# EAGLE design BLMD_MCU (EAGLE 9.6.2)
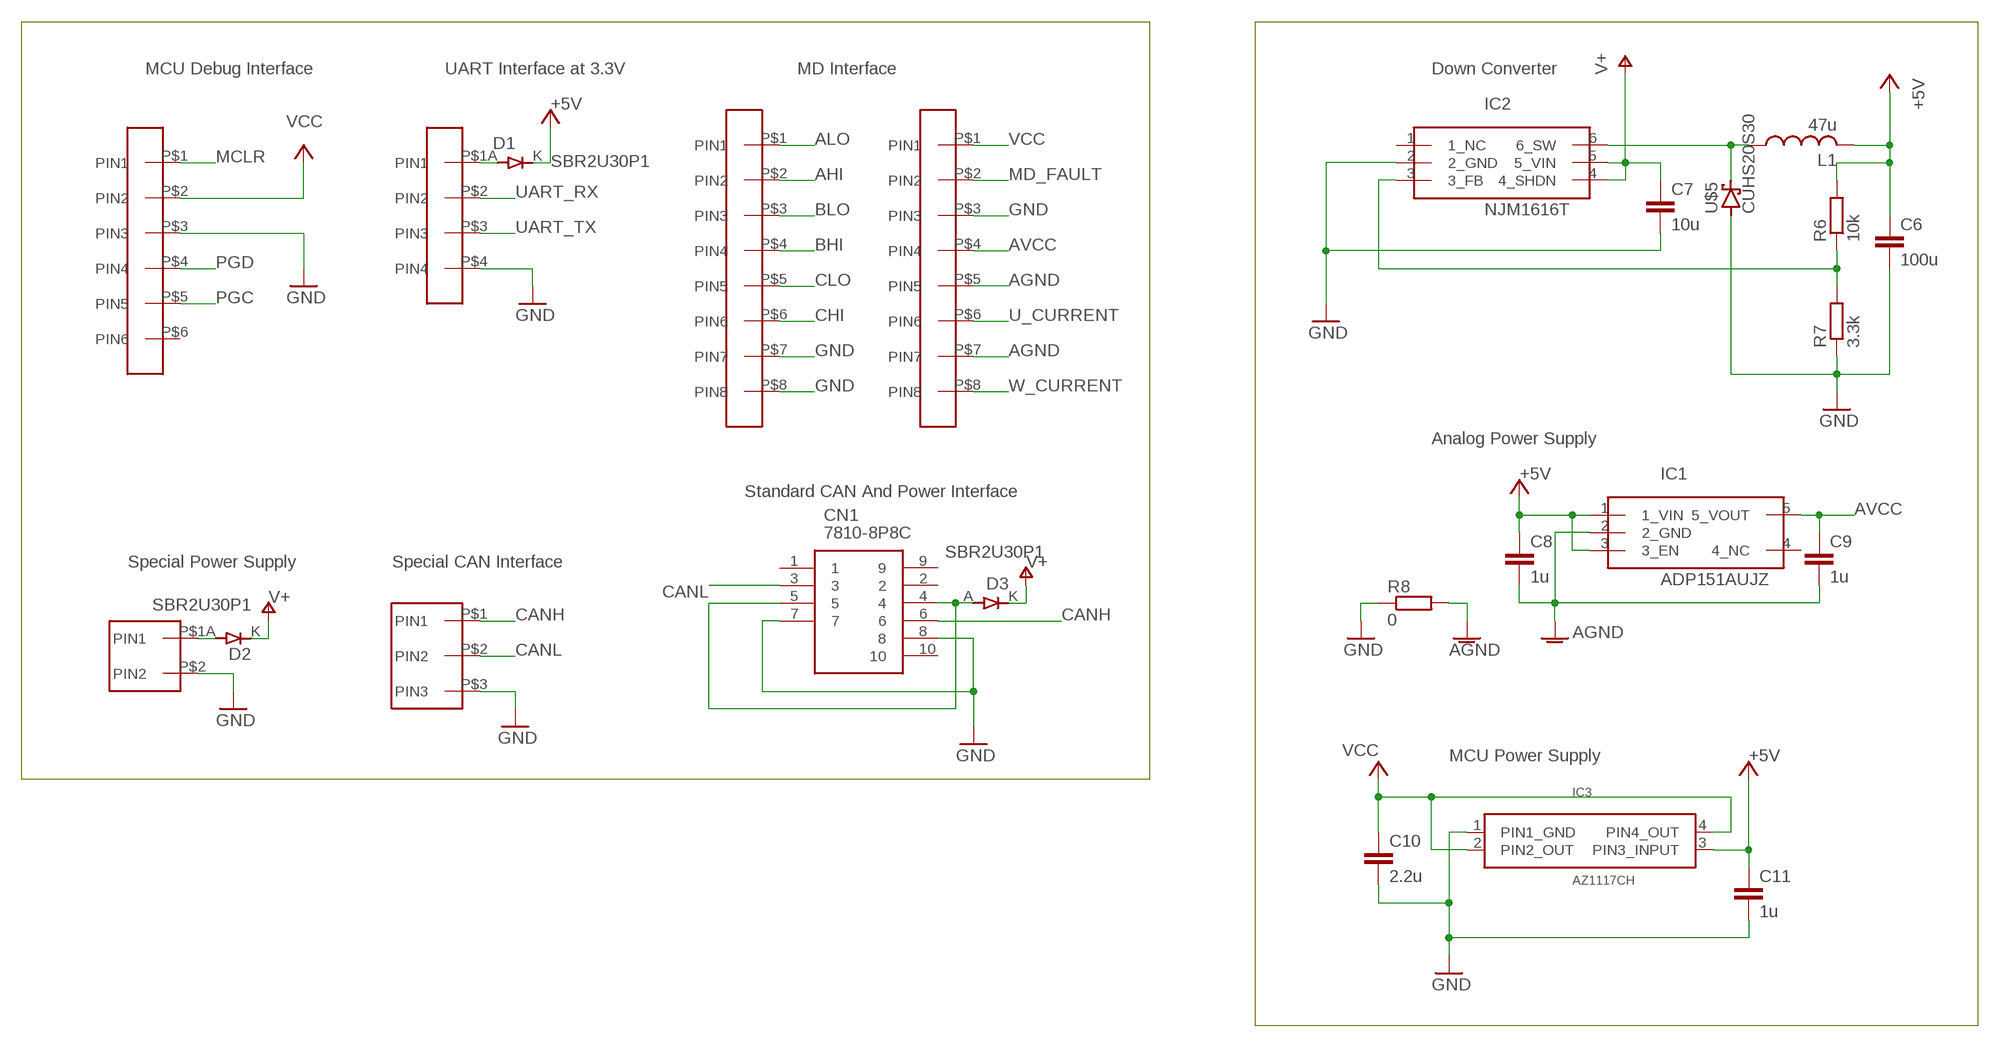
[diagram p0: schematic, sheet 1, part 1 of 2]
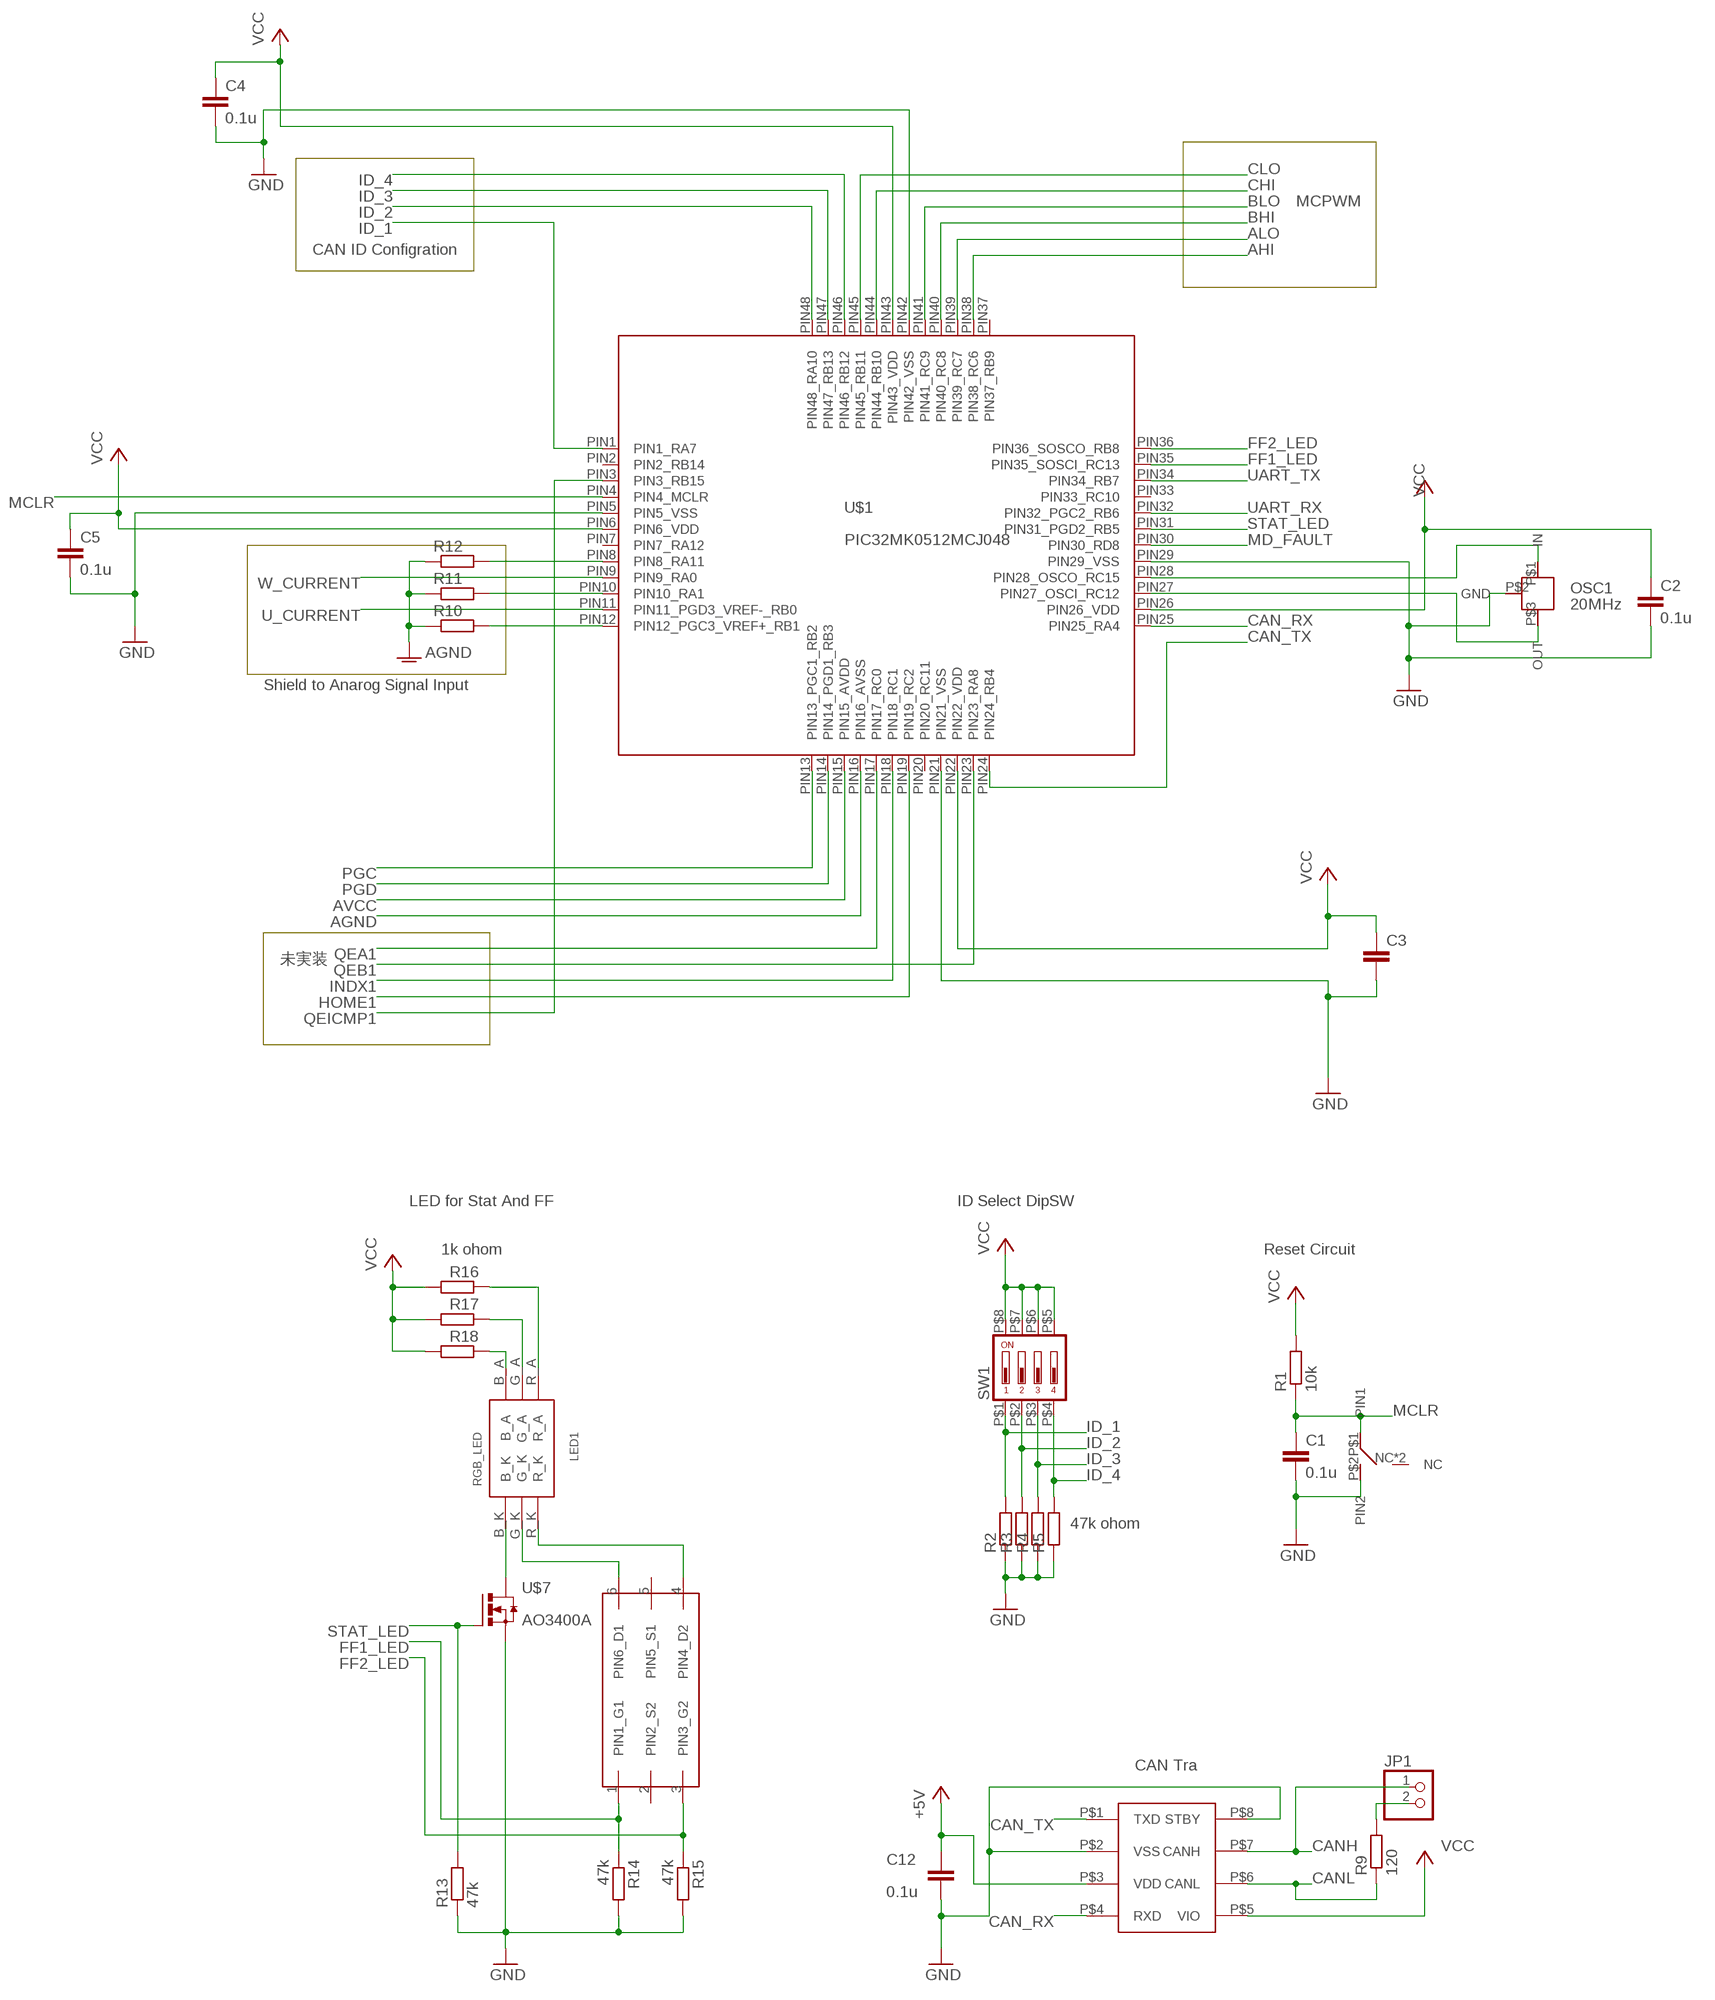
[diagram p1: schematic, sheet 1, part 2 of 2]

## Parts
C1  0.1u  C-EUC1608  [C1608]
C2  0.1u  C-EUC1608  [C1608]
C3  C-EUC1608  [C1608]
C4  0.1u  C-EUC1608  [C1608]
C5  0.1u  C-EUC1608  [C1608]
C6  100u  C-EUC3216  [C3216]
C7  10u  C-EUC1608  [C1608]
C8  1u  C-EUC1608  [C1608]
C9  1u  C-EUC1608  [C1608]
C10  2.2u  C-EUC1608  [C1608]
C11  1u  C-EUC1608  [C1608]
C12  0.1u  C-EUC1608  [C1608]
CN1  7810-8P8C  [78108P8C]
CON1  JQ_S8P  [JQ_S8P]
CON2  JQ_S8P  [JQ_S8P]
CON3  XH_4P  [XH_4P]
CON4  XH_6P  [XH_6P]
CON5  XH_3P  [XH_3P]
D1  SBR2U30P1  SMD_DAIOD  [SOD_123]
D2  SBR2U30P1  SMD_DAIOD  [SOD_123]
D3  SBR2U30P1  SMD_DAIOD  [SOD_123]
IC1  ADP151AUJZ  [SOT23-5]
IC2  NJM1616T  NJW1616T  [SOT23-6]
IC3  AZ1117CH  [SOT223-W]
IC4  MCP2562MCP2561-SN  [SOIC8]
JP1  PINHD-1X2  [1X02]
L1  47u  L_SMD_INDUCTOR  [SMD_INDUCTOR]
LED1  RGB_LED  [RGB_LED]
OSC1  20MHz  CSTN#  [CSTNE#]
R1  10k  R_REG  [1608]
R2  R_REG  [1608]
R3  R_REG  [1608]
R4  R_REG  [1608]
R5  R_REG  [1608]
R6  10k  R_REG  [1608]
R7  3.3k  R_REG  [1608]
R8  0  R_REG  [1608]
R9  120  R_REG  [1608]
R10  R_REG  [1608]
R11  R_REG  [1608]
R12  R_REG  [1608]
R13  47k  R_REG  [1608]
R14  47k  R_REG  [1608]
R15  47k  R_REG  [1608]
R16  R_REG  [1608]
R17  R_REG  [1608]
R18  R_REG  [1608]
SW1  DIPSW4  [DIPSW4]
U$1  PIC32MK0512MCJ048  [LQFP48PIN]
U$2  TVAF06-A020B-R  TAKUTOSUITTI2  [TAKUTOSUITTI2]
U$4  XH_2P  [XH_2P]
U$5  CUHS20S30  [SOD323-W]
U$6  FDC6305  [SSOT6]
U$7  AO3400A  SOT23_NFET  [SOT23]

## Nets
+5V: C6.1 C8.1 C11.1 C12.1 D1.K(C) IC1.1(1_VIN) IC1.3(3_EN) IC3.3(PIN3_INPUT) IC4.P$3(VDD) L1.P$2 R6.2
AGND: C8.2 C9.2 CON2.P$5(PIN5) CON2.P$7(PIN7) IC1.2(2_GND) R8.2 R10.1 R11.1 R12.1 U$1.PIN16(PIN16_AVSS)
AHI: CON1.P$2(PIN2) U$1.PIN38(PIN38_RC6)
ALO: CON1.P$1(PIN1) U$1.PIN39(PIN39_RC7)
AVCC: C9.1 CON2.P$4(PIN4) IC1.5(5_VOUT) U$1.PIN15(PIN15_AVDD)
BHI: CON1.P$4(PIN4) U$1.PIN40(PIN40_RC8)
BLO: CON1.P$3(PIN3) U$1.PIN41(PIN41_RC9)
CAN_RX: IC4.P$4(RXD) U$1.PIN25(PIN25_RA4)
CAN_TX: IC4.P$1(TXD) U$1.PIN24(PIN24_RB4)
CANH: CN1.6 CON5.P$1(PIN1) IC4.P$7(CANH) JP1.1
CANL: CN1.3 CON5.P$2(PIN2) IC4.P$6(CANL) R9.1
CHI: CON1.P$6(PIN6) U$1.PIN44(PIN44_RB10)
CLO: CON1.P$5(PIN5) U$1.PIN45(PIN45_RB11)
FF1_LED: R14.1 U$1.PIN35(PIN35_SOSCI_RC13) U$6.1(PIN1_G1)
FF2_LED: R15.1 U$1.PIN36(PIN36_SOSCO_RB8) U$6.3(PIN3_G2)
GND: C1.2 C2.2 C3.2 C4.2 C5.2 C6.2 C7.2 C10.2 C11.2 C12.2 CN1.7 CN1.8 CON1.P$7(PIN7) CON1.P$8(PIN8) CON2.P$3(PIN3) CON3.P$4(PIN4) CON4.P$3(PIN3) CON5.P$3(PIN3) IC2.2(2_GND) IC3.1(PIN1_GND) IC4.P$2(VSS) IC4.P$8(STBY) OSC1.P$2(GND) R2.1 R3.1 R4.1 R5.1 R7.1 R8.1 R13.1 R14.2 R15.2 U$1.PIN5(PIN5_VSS) U$1.PIN21(PIN21_VSS) U$1.PIN29(PIN29_VSS) U$1.PIN42(PIN42_VSS) U$2.P$2(PIN2) U$4.P$2(PIN2) U$5.A U$7.PIN2(PIN3_S)
HOME1: U$1.PIN19(PIN19_RC2)
ID_1: R2.2 SW1.P$1 U$1.PIN1(PIN1_RA7)
ID_2: R3.2 SW1.P$2 U$1.PIN48(PIN48_RA10)
ID_3: R4.2 SW1.P$3 U$1.PIN47(PIN47_RB13)
ID_4: R5.2 SW1.P$4 U$1.PIN46(PIN46_RB12)
INDX1: U$1.PIN18(PIN18_RC1)
MCLR: C1.1 CON4.P$1(PIN1) R1.1 U$1.PIN4(PIN4_MCLR) U$2.P$1(PIN1)
MD_FAULT: CON2.P$2(PIN2) U$1.PIN30(PIN30_RD8)
N$1: R12.2 U$1.PIN8(PIN8_RA11)
N$2: R11.2 U$1.PIN10(PIN10_RA1)
N$3: LED1.B_A R18.2
N$4: R10.2 U$1.PIN12(PIN12_PGC3_VREF+_RB1)
N$5: OSC1.P$3(OUT) U$1.PIN27(PIN27_OSCI_RC12)
N$6: OSC1.P$1(IN) U$1.PIN28(PIN28_OSCO_RC15)
N$7: LED1.G_A R17.2
N$8: JP1.2 R9.2
N$9: IC2.6(6_SW) L1.P$1 U$5.C
N$10: IC2.3(3_FB) R6.1 R7.2
N$11: LED1.R_A R16.2
N$12: LED1.B_K U$7.PIN3(PIN2_D)
N$13: CON3.P$1(PIN1) D1.A
N$14: LED1.G_K U$6.6(PIN6_D1)
N$15: LED1.R_K U$6.4(PIN4_D2)
N$16: D2.A U$4.P$1(PIN1)
N$18: CN1.4 CN1.5 D3.A
PGC: CON4.P$5(PIN5) U$1.PIN13(PIN13_PGC1_RB2)
PGD: CON4.P$4(PIN4) U$1.PIN14(PIN14_PGD1_RB3)
QEA1: U$1.PIN17(PIN17_RC0)
QEB1: U$1.PIN23(PIN23_RA8)
QEICMP1: U$1.PIN3(PIN3_RB15)
STAT_LED: R13.2 U$1.PIN31(PIN31_PGD2_RB5) U$7.PIN1(PIN1_G)
U_CURRENT: CON2.P$6(PIN6) U$1.PIN11(PIN11_PGD3_VREF-_RB0)
UART_RX: CON3.P$2(PIN2) U$1.PIN32(PIN32_PGC2_RB6)
UART_TX: CON3.P$3(PIN3) U$1.PIN34(PIN34_RB7)
V+: C7.1 D2.K(C) D3.K(C) IC2.4(4_SHDN) IC2.5(5_VIN)
VCC: C2.1 C3.1 C4.1 C5.1 C10.1 CON2.P$1(PIN1) CON4.P$2(PIN2) IC3.2(PIN2_OUT) IC3.4(PIN4_OUT) IC4.P$5(VIO) R1.2 R16.1 R17.1 R18.1 SW1.P$5 SW1.P$6 SW1.P$7 SW1.P$8 U$1.PIN6(PIN6_VDD) U$1.PIN22(PIN22_VDD) U$1.PIN26(PIN26_VDD) U$1.PIN43(PIN43_VDD)
W_CURRENT: CON2.P$8(PIN8) U$1.PIN9(PIN9_RA0)
Unconnected: CN1.1 CN1.2 CN1.9 CN1.10 CON4.P$6(PIN6) IC1.4(4_NC) IC2.1(1_NC) U$1.PIN2(PIN2_RB14) U$1.PIN7(PIN7_RA12) U$1.PIN20(PIN20_RC11) U$1.PIN33(PIN33_RC10) U$1.PIN37(PIN37_RB9) U$2.NC U$2.NC@2(NC) U$6.2(PIN2_S2) U$6.5(PIN5_S1)

## Notes on the sheet
- MCU Debug Interface | UART Interface at 3.3V | MD Interface | Down Converter
- Analog Power Supply
- Standard CAN And Power Interface
- Special Power Supply | Special CAN Interface
- MCU Power Supply
- MCPWM
- CAN ID Configration
- Shield to Anarog Signal Input
- 未実装
- LED for Stat And FF | ID Select DipSW
- 1k ohom | Reset Circuit
- 47k ohom
- CAN Tra

## Library data of the parts
C1-C12 = rcl:C-EU: CAPACITOR, European symbol; SPICEPREFIX: C
CN1 = user_conector:7810-8P8C: Modular Jack, side entry, shielded Source: Datasheet <http://akizukidenshi.com/download/ds/neltron/7810-XPXC_20180312.pdf> RJ45 秋月電子100159; DESCRIPTION: Modular Jack, side entry, shielded; HEIGHT: 14.75mm; MANUFACTURER_NAME: NELTRON; MANUFACTURER_PART_NUMBER: 7810-8P8C
CON1 CON2 = user_conector:JQ_S8P: jst JQコネクタ8pin ソケット 基板対基板コネクタ
CON3 = user_conector:XH_4P: jst JQコネクタ4pin ベース付きポスト 基板対基板コネクタ
CON4 = user_conector:XH_6P
CON5 = user_conector:XH_3P
D1-D3 = user_diode:SMD_DAIOD: パッケージはSOD123
IC1 = user_ic:ADP151AUJZ: アナログデバイセズ 超低ノイズ3.3V出力リニアレギュレータ max current = 200 [mA] 秋月電子 通販コード : I-14180
IC2 = user_ic:NJW1616T: 新日本無線 降圧スイッチングレギュレータIC NJM1616T 秋月電子 通販コード : I-15765
IC3 = user_ic:AZ1117CH: AZ1117CH-3.3TRG1 秋月電子 116155 vout 3.3v dropout 1.2v Imax 1.35A
IC4 = user_ic:MCP2562
JP1 = pinhead:PINHD-1X2: PIN HEADER
L1 = user_rcl:L_SMD_INDUCTOR: 秋月電子通商 NRシリーズ
LED1 = user_leds:RGB_LED: KPF-3236SURKMGKPBC 秋月電子通商 117060
OSC1 = user_osc:CSTN#: ムラタのセラロック （セラミック振動子） 周波数はいくつか種類あり(valueで設定して) 秋月電子通商のトップ/パーツ一般/発振子/セラミック発振子 uCからのoutが入るのがinであることに注意 https://akizukidenshi.com/catalog/c/cceralock/
R1-R18 = user_rcl:R_REG: チップ抵抗
SW1 = user_swich:DIPSW4: OTAX 表面実装4接点DIPスイッチ 秋月電子 通販コード : P-08929
U$1 = user_ic:PIC32MK0512MCJ048: PIC32MK0512MCJ048 仕様 1. 定格3.3V、32bitMCU、FPU搭載、CAN-FD、QEI 2. モータコントロール向けマイコン
U$2 = user_swich:TAKUTOSUITTI2: 表面実装タクトスイッチ 秋月電子通称通販コード[P-14888]
U$4 = user_conector:XH_2P: トップ型xhコネクタ2ピン 秋月に売ってるやつ
U$5 = user_diode:CUHS20S30: CUHS20S30 秋月電子:116304 Vf=0.25 Aav=2
U$6 = user_tr_fet_igbt:FDC6305: デュアルNchMOSFET ゲート・ソース間絶対最大定格8v 秋月電子通商通販コード[I-06003]
U$7 = user_tr_fet_igbt:SOT23_NFET

## Board
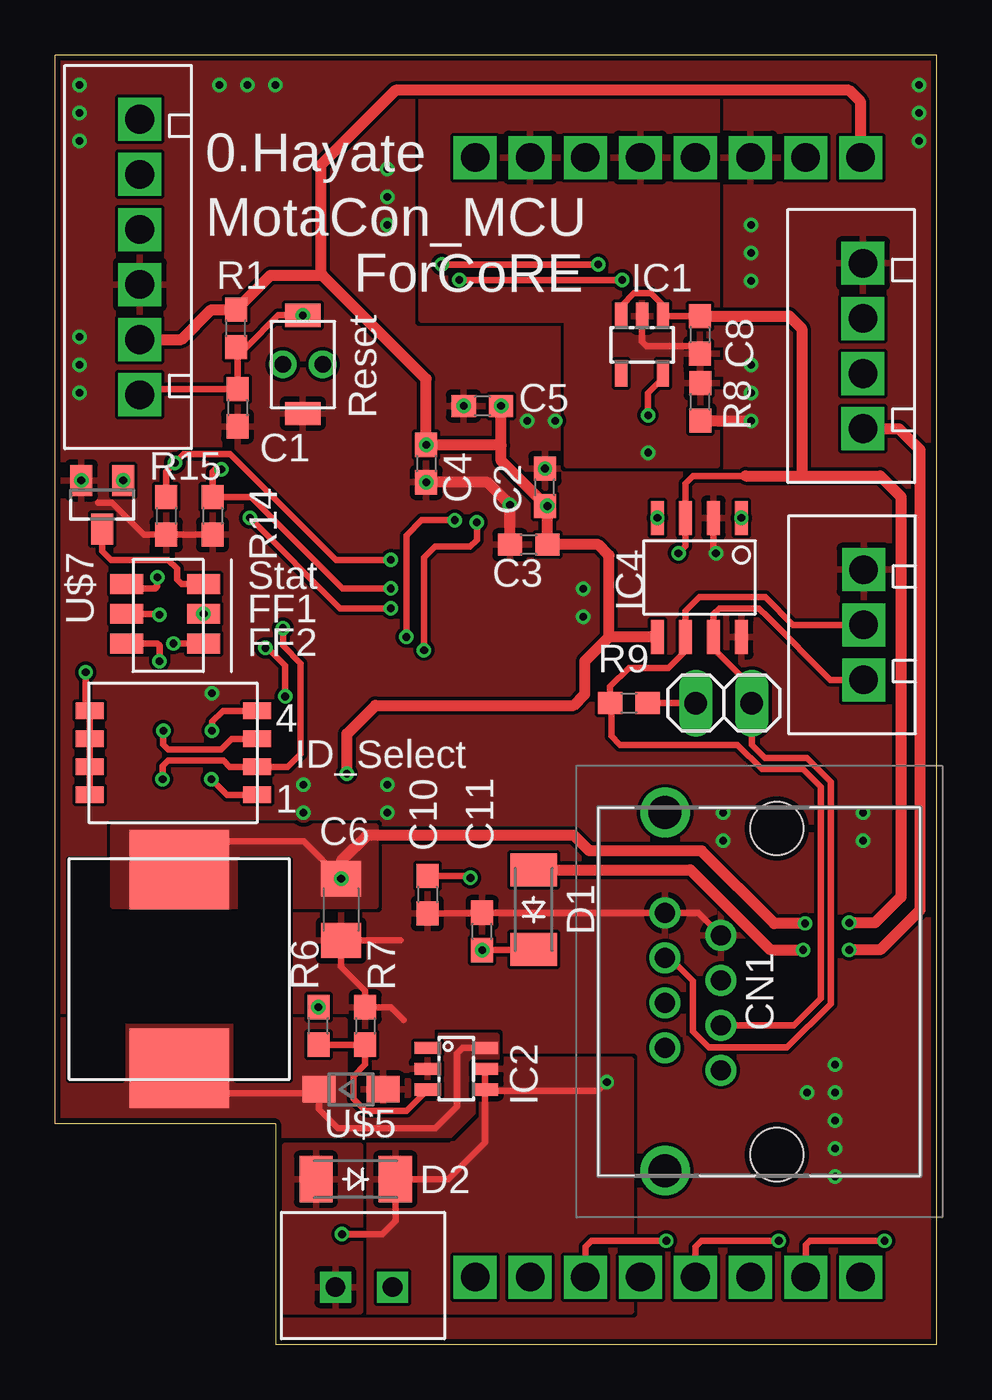
[diagram p2: board, top side]
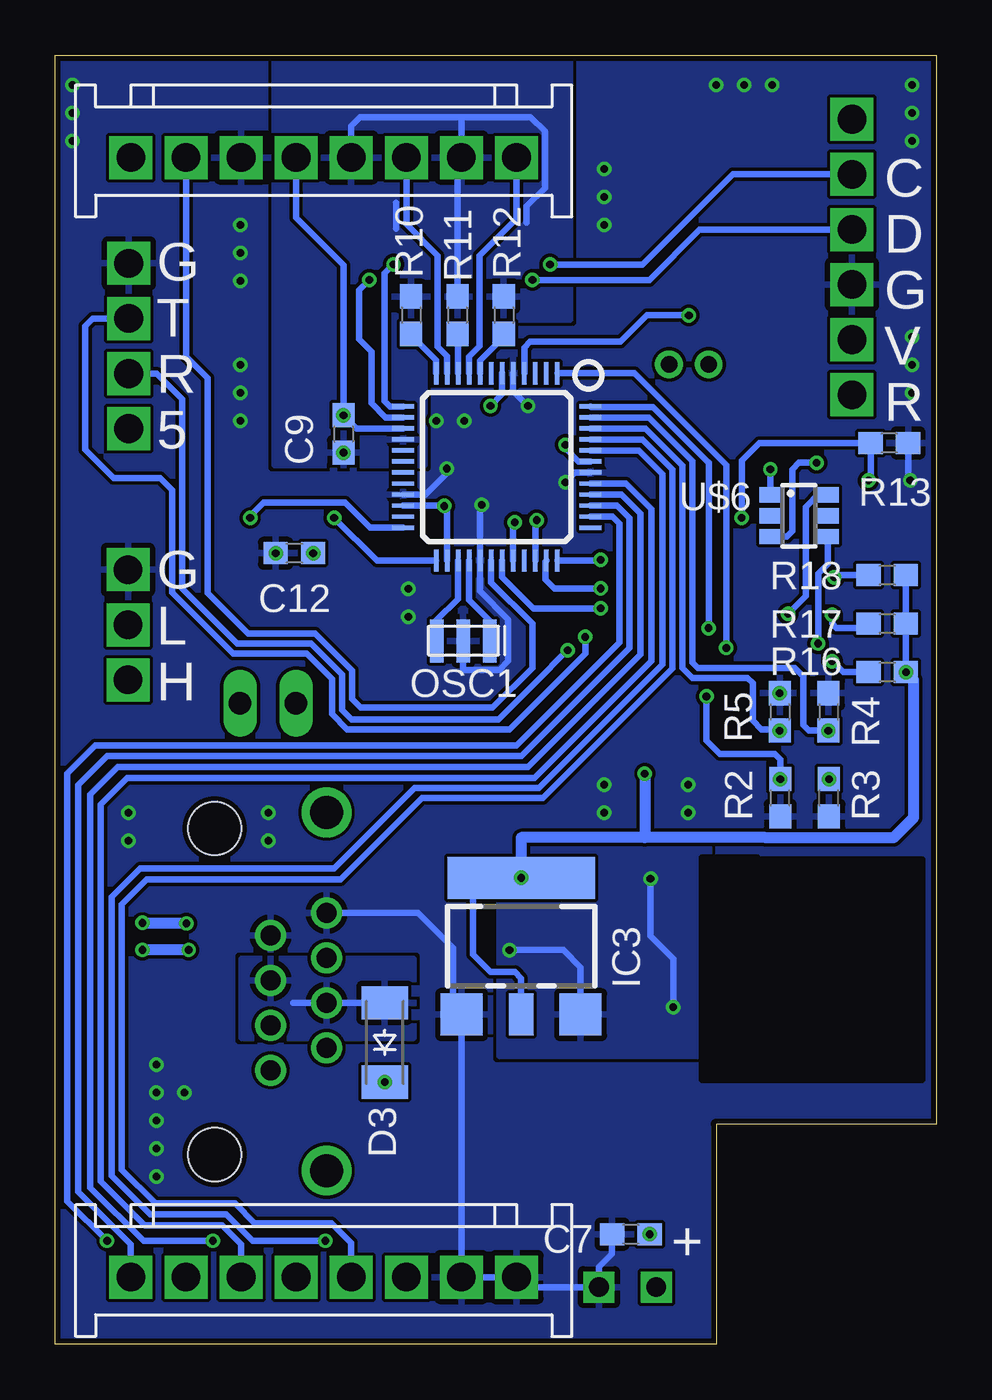
[diagram p3: board, bottom side, seen from below]

Size 40 x 58.5 mm. Coordinates in mm from the lower left corner, seen from the top.
Outline: 10,0 40,0 40,58.5 0,58.5 0,10 10,10 10,0
Copper layers (1*16): Top 0.035mm / dielectric 1.5mm / Bottom 0.035mm
Design rules "SeeedStudio_2layer_DRU_no_angle_20140221": minimum track width 6mil, minimum drill 12mil, track to track 6mil, track to pad 6mil, pad to pad 6mil, via to via 6mil, smd to smd 0mil, copper to edge 10mil, drill to drill 10mil, minimum pad ring 10mil, minimum via ring 6mil, stop-mask expansion 2mil, vias tented up to drill 100mil, thermal gap 10mil

### Footprints (pad centres in the part's own frame; a part is rotated, then mirrored left to right if it is on the bottom)
C1608 = smd 1.1 x 1: 1 -0.85,0; 2 0.85,0
C3216 = smd 1.6 x 1.8: 1 -1.4,0; 2 1.4,0
78108P8C = drill 0.9 pad 1.4: 1 0,0; 2 1.02,2.54; 3 2.04,0; 4 3.06,2.54; 5 4.08,0; 6 5.1,2.54; 7 6.12,0; 8 7.14,2.54 | drill 1.5 pad 2.25: 9 -4.555,2.54; 10 11.695,2.54 | hole 2.4: -3.83,-2.54; 10.97,-2.54
JQ_S8P = drill 1.3 square: P$1 2.5,2.7; P$2 5,2.7; P$3 7.5,2.7; P$4 10,2.7; P$5 12.5,2.7; P$6 15,2.7; P$7 17.5,2.7; P$8 20,2.7
XH_4P = drill 1.3 square: P$1 2.45,2.35; P$2 4.95,2.35; P$3 7.45,2.35; P$4 9.95,2.35
XH_6P = drill 1.3 square: P$1 2.45,2.35; P$2 4.95,2.35; P$3 7.45,2.35; P$4 9.95,2.35; P$5 12.45,2.35; P$6 14.95,2.35
XH_3P = drill 1.3 square: P$1 2.45,2.35; P$2 4.95,2.35; P$3 7.45,2.35
SOD_123 = smd 1.5 x 2.1: A 1.8,0; K -1.8,0
SOT23-5 = smd 0.55 x 1.2: 1 -0.95,-1.3; 2 0,-1.3; 3 0.95,-1.3; 4 0.95,1.3; 5 -0.95,1.3
SOT23-6 = smd 0.55 x 1.2: 1 -0.95,-1.3; 2 0,-1.3; 3 0.95,-1.3; 4 0.95,1.3; 5 0,1.3; 6 -0.95,1.3
SOT223-W = smd 1.9 x 1.9: 1 -2.7,-3.1; 3 2.7,-3.1 | smd 1.1 x 1.9: 2 0,-3.1 | smd 6.7 x 1.9: 4 0,3.1
SOIC8 = smd 1.55 x 0.6: P$1 -2.7,1.905; P$2 -2.7,0.635; P$3 -2.7,-0.635; P$4 -2.7,-1.905; P$5 2.7,-1.905; P$6 2.7,-0.635; P$7 2.7,0.635; P$8 2.7,1.905
1X02 = drill 1.016 long: 1 -1.27,0; 2 1.27,0
SMD_INDUCTOR = smd 3.6 x 4.5: P$1 0,0; P$2 9,0
RGB_LED = smd 1.5 x 0.9: B_A 3.5,-2.7; B_K 0,-2.7; G_A 3.5,-1.35; G_K 0,-1.35; R_A 3.5,0; R_K 0,0
CSTNE# = smd 0.6 x 1.95: P$1 0,0; P$2 1.2,0; P$3 2.4,0
1608 = smd 1.1 x 1: 1 -0.85,0; 2 0.85,0
DIPSW4 = smd 0.76 x 1.27: P$1 -1.27,-3.81; P$2 0,-3.81; P$3 1.27,-3.81; P$4 2.54,-3.81; P$5 2.54,3.79; P$6 1.27,3.79; P$7 0,3.79; P$8 -1.27,3.79
LQFP48PIN = smd 0.2 x 1: PIN1 -2.75,-4.25; PIN2 -2.25,-4.25; PIN3 -1.75,-4.25; PIN4 -1.25,-4.25; PIN5 -0.75,-4.25; PIN6 -0.25,-4.25; PIN7 0.25,-4.25; PIN8 0.75,-4.25; PIN9 1.25,-4.25; PIN10 1.75,-4.25; PIN11 2.25,-4.25; PIN12 2.75,-4.25; PIN25 2.75,4.25; PIN26 2.25,4.25; PIN27 1.75,4.25; PIN28 1.25,4.25; PIN29 0.75,4.25; PIN30 0.25,4.25; PIN31 -0.25,4.25; PIN32 -0.75,4.25; PIN33 -1.25,4.25; PIN34 -1.75,4.25; PIN35 -2.25,4.25; PIN36 -2.75,4.25 | smd 1 x 0.2: PIN13 4.25,-2.75; PIN14 4.25,-2.25; PIN15 4.25,-1.75; PIN16 4.25,-1.25; PIN17 4.25,-0.75; PIN18 4.25,-0.25; PIN19 4.25,0.25; PIN20 4.25,0.75; PIN21 4.25,1.25; PIN22 4.25,1.75; PIN23 4.25,2.25; PIN24 4.25,2.75; PIN37 -4.25,2.75; PIN38 -4.25,2.25; PIN39 -4.25,1.75; PIN40 -4.25,1.25; PIN41 -4.25,0.75; PIN42 -4.25,0.25; PIN43 -4.25,-0.25; PIN44 -4.25,-0.75; PIN45 -4.25,-1.25; PIN46 -4.25,-1.75; PIN47 -4.25,-2.25; PIN48 -4.25,-2.75
TAKUTOSUITTI2 = drill 0.75: NC 2.225,-0.9; NC@2 2.225,0.9 | smd 1.05 x 1.6: P$1 0,0; P$2 4.45,0
XH_2P = drill 0.9 square: P$1 2.45,2.35; P$2 5.05,2.35
SOD323-W = smd 1.5 x 1.2: A 1.45,0; C -1.45,0
SSOT6 = smd 0.69 x 0.99: 1 -0.95,-1.3; 2 0,-1.3; 3 0.95,-1.3; 4 0.95,1.3; 5 0,1.3; 6 -0.95,1.3
SOT23 = smd 1 x 1.4: PIN1 -0.95,-1.1; PIN2 0.95,-1.1; PIN3 0,1.1

### Placement (x,y rotation side)
C1  8.28,42.5 270 top
C2  22.23,38.89 90 top
C3  21.49,36.29 180 top
C4  16.84,39.97 270 top
C5  19.39,42.58 180 top
C6  12.98,19.73 270 top
C7  13.87,5 180 bottom
C8  29.26,45.81 270 top
C9  26.91,41.31 270 bottom
C10  16.9,20.41 270 top
C11  19.38,18.74 90 top
C12  29.14,35.9 180 bottom
CN1  30.22,12.44 90 top
CON1  39.06,0.35 0 bottom
CON2  39.06,51.15 0 bottom
CON3  39.01,39.1 90 top
CON4  6.19,40.64 90 top
CON5  39.04,27.7 90 top
D1  21.72,19.73 90 top
D2  13.64,7.5 180 top
D3  25.04,13.7 90 bottom
IC1  26.64,45.36 180 top
IC2  18.21,12.51 270 top
IC3  18.85,18.07 0 bottom
IC4  29.24,34.8 270 top
JP1  30.34,29.1 180 top
L1  5.64,12.54 90 top
LED1  6.74,31.8 180 top
OSC1  20.28,31.92 180 bottom
R1  8.21,46.1 90 top
R2  7.09,24.8 90 bottom
R3  4.88,24.8 90 bottom
R4  4.91,28.7 270 bottom
R5  7.12,28.7 270 bottom
R6  11.95,14.45 90 top
R7  14.07,14.45 270 top
R8  29.28,42.77 90 top
R9  26.04,29.1 0 top
R10  23.84,46.7 270 bottom
R11  21.74,46.7 270 bottom
R12  19.64,46.7 270 bottom
R13  2.14,40.9 180 bottom
R14  7.14,37.6 270 top
R15  5.04,37.6 270 top
R16  2.24,30.5 180 bottom
R17  2.24,32.7 180 bottom
R18  2.24,34.9 180 bottom
SW1  5.35,26.21 90 top
U$1  19.96,39.81 180 bottom
U$2  11.24,46.69 270 top
U$4  10.27,0.25 0 top
U$5  13.43,11.58 0 top
U$6  6.24,37.6 270 bottom
U$7  2.14,38.1 180 top

### Tracks (layer width: path | path; a pad name or v marks a point on that pad's centre or on a via)
+5V  (via drill 0.35)
  Top 0.305: L1.P$2 6.91,22.81 11.3,22.81 C6.1 | D1.K 21.68,17.89 C11.1 | C8.1 IC1.1 27.59,47.15 27.04,47.7 26.27,47.7 25.69,47.12 IC1.3 | 31.34,39.4 28.94,39.4 28.61,39.06 IC4.P$3 28.61,36.22 C12.1
  Top 0.508: C8.1 33.32,46.66 33.88,46.1 33.88,39.4 | 31.34,39.4 33.88,39.4 | 33.88,39.4 37.44,39.4 38.38,38.46 38.38,20.3 37.21,19.13 v36.04,19.13 | C6.1 12.98,21.93 14.15,23.1 23.54,23.1 24.24,22.4 29.34,22.4 32.64,19.1 v34.04,19.1
  Bottom 0.305: R6.2 11.95,17.5 12.98,18.53 C6.1 | IC3.3 16.15,17.11 16.93,17.89 C11.1
  Bottom 0.508: v36.04,19.13 34.07,19.13 v34.04,19.1
  other vias: 11.95,15.3 12.98,21.13 19.38,17.89 28.29,35.9
  pour Top (isolate 0.305, rank 2, no thermals): 2.64,23.5 14.54,23.5 14.54,19.9 2.64,19.9
  pour Bottom (rank 2): 10.34,23.5 10.34,13.1 19.84,13.1 19.84,23.5
AGND  (via drill 0.35)
  Top 0.305: IC1.2 26.64,45.5 26.84,45.3 28.92,45.3 C8.2
  Bottom 0.305: 18.6,50.89 18.6,51.64 17.78,52.46 17.78,55.04 18.42,55.68 21.56,55.68 | 21.56,55.68 21.56,54 | 21.56,54 CON2.P$7 | R11.1 21.74,53.82 21.56,54 | 24.52,50.63 24.52,51.81 | CON2.P$5 26.56,55.28 26.16,55.68 21.56,55.68
  other vias: 26.91,40.46
  pour Bottom (rank 2): 23.24,39.9 30.04,39.9 30.04,60.4 16.64,60.4 16.64,46.5 23.24,46.5
  pour Top (rank 2): 16.64,60.4 30.04,60.4 30.04,39.9 23.24,39.9 23.24,46.5 16.64,46.5
AHI  (via drill 0.35)
  Top 0.305: CON1.P$2 34.06,4.52 34.24,4.7 v37.64,4.7
  Bottom 0.305: U$1.PIN38 14.71,37.56 14.4,37.25 14.4,31.84 19.07,27.17 38.19,27.17 39.44,25.92 39.44,6.5 v37.64,4.7
ALO
  Bottom 0.305: CON1.P$1 36.56,4.55 38.94,6.93 38.94,25.39 37.63,26.7 18.84,26.7 13.94,31.6 13.94,37.5 14.5,38.06 U$1.PIN39
AVCC  (via drill 0.35)
  Top 0.305: IC1.5 27.59,43.84 26.91,43.16 C9.1
  Bottom 0.305: U$1.PIN15 26.31,41.56 C9.1 26.91,48.97 29.06,51.12 CON2.P$4
  other vias: 26.91,42.16
BHI  (via drill 0.35)
  Top 0.305: CON1.P$4 29.06,4.42 29.34,4.7 v32.84,4.7
  Bottom 0.305: U$1.PIN40 14.3,38.56 13.44,37.7 13.44,31.3 18.54,26.2 37.15,26.2 38.4,24.95 38.4,7.11 35.99,4.7 v32.84,4.7
BLO
  Bottom 0.305: CON1.P$3 31.56,4.54 32.42,5.4 35.94,5.4 37.94,7.4 37.94,24.49 36.73,25.7 18.24,25.7 12.94,31 12.94,37.9 14.1,39.06 U$1.PIN41
CAN_RX  (via drill 0.35)
  Bottom 0.305: U$1.PIN25 25.39,35.56 v27.34,37.5
CAN_TX  (via drill 0.35)
  Bottom 0.305: U$1.PIN24 25.7,37.06 26.84,38.2 30.54,38.2 31.14,37.59 IC4.P$1
  other vias: 31.14,37.5
CANH
  Top 0.305: CN1.6 27.9,17.54 28.94,16.5 28.94,14.2 29.67,13.47 33.21,13.47 35.2,15.46 35.2,25.51 34.11,26.6 32.21,26.6 31.61,27.2 JP1.1 31.61,29.83 29.88,31.57 IC4.P$7 29.88,33.13 30.14,33.4 31.94,33.4 32.34,33 35.19,30.15 CON5.P$1
CANL
  Top 0.305: CON5.P$2 33.49,32.65 32.24,33.9 29.24,33.9 28.61,33.27 IC4.P$6 28.61,31.46 27.84,30.7 26.04,30.7 25.19,29.85 R9.1 25.24,29.05 25.24,27.6 25.64,27.2 30.96,27.2 32.06,26.1 33.94,26.1 34.74,25.3 34.74,15.7 33.52,14.48 CN1.3
CHI  (via drill 0.35)
  Top 0.305: CON1.P$6 24.06,4.42 24.34,4.7 v27.74,4.7
  Bottom 0.305: U$1.PIN44 13.5,40.56 12.44,39.5 12.44,30.85 18.05,25.24 23.7,25.24 27.34,21.6 36.14,21.6 37.44,20.3 37.44,7.65 35.69,5.9 32.24,5.9 31.04,4.7 v27.74,4.7
CLO
  Bottom 0.305: CON1.P$5 26.56,4.6 27.46,5.5 30.94,5.5 31.84,6.4 35.45,6.4 36.97,7.92 36.97,19.97 35.84,21.1 27.04,21.1 23.35,24.79 17.86,24.79 11.98,30.66 11.98,39.69 13.35,41.06 U$1.PIN45
FF1_LED  (via drill 0.35)
  Top 0.305: v7.54,39.7 7.24,39.7 7.14,39.6 R14.1 8.89,38.45 13.04,34.3 v15.24,34.3
  Bottom 0.305: U$6.1 v7.54,39.7 | U$1.PIN35 17.74,35.53 17.74,34.7 17.34,34.3 v15.24,34.3
FF2_LED  (via drill 0.35)
  Top 0.305: R15.1 5.04,39.6 v5.44,40 5.84,40.4 7.94,40.4 12.74,35.6 v15.24,35.6
  Bottom 0.305: v5.44,40 6.24,40 6.54,39.7 6.54,36.9 6.79,36.65 U$6.3 | U$1.PIN36 15.24,35.56 v15.24,35.6
GND  (via drill 0.35)
  Top 0.305: CN1.7 29.2,19.58 CN1.8 C11.2 | C11.2 | C10.2 19.35,19.56 C11.2 | 15.67,18.33 C6.2 12.98,17.13 14.07,16.04 R7.1 15.24,15.3 15.81,14.73 | R14.2 R15.2 4.02,36.75 2.58,38.2 1.96,38.2 | U$7.PIN2 1.19,38.97 | IC4.P$2 29.88,35.9 C12.2 | v31.58,41.92 v31.59,41.91
  Top 0.508: C3.2 v20.64,38.1 19.62,39.12 C4.2 | R8.1 v31.58,41.92
  Bottom 0.305: OSC1.P$2 21.48,30.6 19.84,30.6 19.44,31 19.44,32.9 20.71,34.17 U$1.PIN29 20.71,38.03 v20.64,38.1 | C7.2 14.72,4.12 15.32,3.52 U$4.P$2 18.61,2.6 CON1.P$8 21.4,3.05 21.55,3.2 | CN1.8 23.52,19.58 21.94,18 21.94,15.36 IC3.1 21.55,3.2 | 21.55,3.2 CON1.P$7 | R13.1 1.29,39.3 U$7.PIN2 | U$1.PIN5 19.21,43.25 C5.2 | U$1.PIN42 16.4,39.56 C4.2 | U$1.PIN21 23.18,38.56 22.23,39.51 C2.2
  other vias: 1.19,39.2 29.99,35.9 18.54,42.58 16.84,39.12 22.23,39.74 1.11,57.15 1.11,55.88 1.11,54.61 1.11,45.72 1.11,44.45 1.11,43.18 7.46,57.15 8.73,57.15 10,57.15 15.08,53.34 15.08,52.07 15.08,50.8 31.59,48.26 31.59,49.53 31.59,50.8 39.21,54.61 39.21,55.88 39.21,57.15 22.7,41.91 21.43,41.91 23.97,34.29 23.97,33.02 11.27,25.4 11.27,24.13 15.08,25.4 15.08,24.13 30.32,24.13 30.32,22.86 36.67,24.13 36.67,22.86 34.13,11.43 35.4,12.7 35.4,11.43 35.4,10.16 35.4,8.89 35.4,7.62 31.59,43.18 31.59,44.45 7.12,29.55
  cutout Bottom (rank 2): 0.64,22 8.14,22 8.14,22.1 10.64,22.1 10.64,12 0.64,12
  pour Bottom (rank 5): -8.36,64.5 45.64,64.5 45.64,-2.7 -8.36,-2.7
  pour Top (rank 5): -10.46,65.8 50.94,65.8 50.94,-8.8 -10.46,-8.8
  cutout Top: 0.64,22 2.14,22 2.14,19.6 2.14,19.4 2.14,19.3 8.44,19.3 8.44,22 10.64,22 10.64,12.1 10.64,12 8.24,12 8.24,14.7 3.04,14.7 3.04,12 0.64,12
ID_1  (via drill 0.35)
  Top 0.305: SW1.P$1 7.8,24.94 R2.2 | v10.44,29.4 10.44,30.8 9.64,31.6 v9.54,31.6
  Bottom 0.305: R2.2 7.09,26.55 7.34,26.8 9.84,26.8 10.44,27.4 v10.44,29.4 | v9.54,31.6 9.54,39.9 13.7,44.06 U$1.PIN1
  other vias: 7.09,25.65
ID_2  (via drill 0.35)
  Top 0.305: R3.2 4.88,26.24 5.14,26.5 7.64,26.5 7.93,26.21 SW1.P$2 10.55,26.21 11.14,26.8 11.14,30.9 10.34,31.7 v10.34,32.5
  Bottom 0.305: U$1.PIN48 15.67,42.52 12.86,42.52 10.34,39.99 10.34,40 v10.34,32.5
  other vias: 4.88,25.65
ID_3  (via drill 0.35)
  Top 0.305: SW1.P$3 8.02,27.48 7.54,27 5.14,27 4.91,27.23 R4.2
  Bottom 0.305: U$1.PIN47 13.05,42.06 11.07,40.08 11.07,30.93 10.84,30.7 6.44,30.7 6.04,30.3 6.04,28.1 5.79,27.85 R4.2
  other vias: 4.91,27.85
ID_4  (via drill 0.35)
  Top 0.305: SW1.P$4 7.62,28.75 7.12,28.25 R5.2
  Bottom 0.305: U$1.PIN46 13.2,41.56 11.53,39.89 11.53,30.7 11.07,30.24 8.58,30.24 8.34,30 8.34,28.3 7.94,27.9 7.17,27.9 R5.2
  other vias: 7.12,27.85
MCLR  (via drill 0.35)
  Top 0.305: CON4.P$1 4.1,43.35 C1.1 8.28,45.18 R1.1 8.69,45.25 10.13,46.69 U$2.P$1
  Bottom 0.305: U$1.PIN4 18.71,45.23 18.44,45.5 14.34,45.5 13.15,46.69 U$2.P$1
  other vias: 11.24,46.69
MD_FAULT
  Bottom 0.305: CON2.P$2 34.06,44.82 33.08,43.84 33.08,34.09 31.25,32.26 28.2,32.26 26.53,30.58 26.53,29.29 26.14,28.9 20.14,28.9 18.34,30.7 18.34,32.7 20.21,34.57 U$1.PIN30
N$1
  Bottom 0.305: U$1.PIN8 20.71,44.63 19.64,45.7 R12.2
N$2
  Bottom 0.305: U$1.PIN10 21.71,45.82 R11.2
N$3  (via drill 0.35)
  Top 0.305: v4.64,34.8 4.64,34.4 4.54,34.3 3.44,34.3 LED1.B_A
  Bottom 0.305: R18.2 4.54,34.9 v4.64,34.8
N$4
  Bottom 0.305: U$1.PIN12 22.71,44.66 23.84,45.79 R10.2
N$5
  Bottom 0.305: OSC1.P$3 22.68,32.86 21.71,33.83 U$1.PIN27
N$6
  Bottom 0.305: OSC1.P$1 20.28,32.84 21.21,33.77 U$1.PIN28
N$7  (via drill 0.35)
  Top 0.305: LED1.G_A 4.69,33.15 v4.74,33.1
  Bottom 0.305: v4.74,33.1 4.74,32.7 4.54,32.5 3.29,32.5 R17.2
N$8
  Top 0.305: R9.2 JP1.2
N$9
  Top 0.305: IC2.6 18.5,13.46 18.24,13.2 18.24,10.8 17.24,9.8 12.84,9.8 11.98,10.66 11.98,11.4 | 11.98,11.4 U$5.C | 11.98,11.4 5.94,11.4 5.64,11.7 L1.P$1
  pour Top (rank 2, no thermals): 20.04,14 20.04,13 18.94,13 18.94,10.5 17.94,9.5 -0.16,9.5 -0.16,14.7 13.14,14.7 13.14,10.9 17.44,10.9 17.44,14
N$10
  Top 0.305: IC2.3 15.95,10.6 14.08,10.6 13.54,11.14 13.54,12.17 14.07,12.7 R7.2 R6.1
N$11  (via drill 0.35)
  Top 0.305: v4.74,31 4.74,31.7 4.64,31.8 LED1.R_A
  Bottom 0.305: R16.2 4.24,30.5 v4.74,31
N$12
  Top 0.305: U$7.PIN3 2.14,36 2.54,35.6 5.14,35.6 5.54,35.2 5.54,34.7 5.74,34.5 LED1.B_K
N$13  (via drill 0.35)
  Top 0.508: CON3.P$1 38.29,41.55 39.24,40.6 39.24,19.7 37.44,17.9 v36.04,17.9 | v33.94,17.9 32.45,17.9 28.82,21.53 D1.A
  Bottom 0.508: v33.94,17.9 v36.04,17.9
N$14  (via drill 0.35)
  Bottom 0.305: U$6.6 5.04,38.65 5.29,38.65 5.94,38 5.94,33.95 LED1.G_K
  other vias: 6.74,33.15
N$15  (via drill 0.35)
  Top 0.305: LED1.R_K v5.37,31.8
  Bottom 0.305: v5.37,31.8 5.37,34.97 4.94,35.4 U$6.4
N$16
  pour Top (rank 2): 10.44,9 13.84,9 13.84,1.6 13.84,1.5 10.44,1.5
N$18
  Bottom 0.305: 29.2,15.5 CN1.4 D3.A
  pour Bottom (rank 2): 23.74,17.5 31.54,17.5 31.54,13.9 23.74,13.9
PGC  (via drill 0.35)
  Top 0.305: v24.64,49 v17.54,49
  Bottom 0.305: CON4.P$5 9.25,53.09 13.34,49 v17.54,49 | v24.64,49 25.04,48.6 25.04,42.8 24.8,42.56 U$1.PIN13
PGD  (via drill 0.35)
  Top 0.305: v25.74,48.3 v18.34,48.3
  Bottom 0.305: CON4.P$4 10.75,50.59 13.04,48.3 v18.34,48.3 | U$1.PIN14 25,42.06 25.64,42.7 25.64,45.05 26.2,45.61 26.2,47.84 v25.74,48.3
STAT_LED  (via drill 0.35)
  Top 0.305: v8.84,37.5 12.94,33.4 v15.24,33.4
  Bottom 0.305: U$7.PIN1 2.99,39.3 R13.2 8.04,40.9 8.84,40.1 v8.84,37.5 | v15.24,33.4 18.29,33.4 19.71,34.82 U$1.PIN31
  other vias: 3.09,39.2
U_CURRENT
  Bottom 0.305: U$1.PIN11 22.21,44.84 22.64,45.27 22.64,49.4 24.06,50.82 CON2.P$6
UART_RX  (via drill 0.35)
  Top 0.305: v19.14,37.3 19.14,36.5 18.84,36.2 17.24,36.2 16.74,35.7 v16.74,31.5
  Bottom 0.305: U$1.PIN32 19.21,37.23 v19.14,37.3 | CON3.P$2 35.39,44.05 34.24,42.9 34.24,34.3 31.74,31.8 28.39,31.8 26.98,30.39 26.98,28.79 26.55,28.36 19.88,28.36 18.23,30 18.23,30.01 v16.74,31.5
UART_TX  (via drill 0.35)
  Top 0.305: v18.14,37.4 16.64,37.4 15.94,36.7 v15.94,32.1
  Bottom 0.305: U$1.PIN34 18.21,37.33 v18.14,37.4 | CON3.P$3 38.29,46.55 38.64,46.2 38.64,40.6 37.34,39.3 35.24,39.3 34.7,38.76 34.7,34.11 31.93,31.34 28.58,31.34 27.44,30.2 27.44,28.6 26.74,27.9 19.39,27.9 15.94,31.35 v15.94,32.1
V+  (via drill 0.35)
  Top 0.305: C7.1 14.84,5 15.44,5.6 D2.K 17.84,7.5 19.51,9.17 19.51,11.5 | 19.51,11.5 IC2.4 IC2.5 | D3.K 24.64,11.5 19.51,11.5
  other vias: 13.02,5 25.04,11.9
  pour Top (rank 3): 10.44,9 10.44,1.5 26.14,1.5 26.14,12.9 19.14,12.9 18.74,12.5 18.74,9.8 17.94,9
VCC  (via drill 0.35)
  Top 0.305: SW1.P$8 SW1.P$7 SW1.P$6 SW1.P$5 1.39,28.92 R16.1 | C10.1 18.76,21.26 IC3.4
  Top 0.508: C2.1 v22.34,38.04 | v22.34,38.04 22.3,38.04 20.24,40.1 20.24,40.8 | 20.24,40.8 C5.1 | 20.24,40.8 20.22,40.82 C4.1 16.84,43.8 12.14,48.5 12.04,48.5 | v22.34,38.04 C3.1 24.65,36.29 25.14,35.8 25.14,32.1 | v13.24,25.9 13.24,27.7 14.54,29 23.54,29 24.04,29.5 24.04,31 25.14,32.1 | IC4.P$5 25.14,32.1 | 12.04,48.5 9.76,48.5 R1.2 7.09,46.95 5.74,45.6 CON4.P$2 | CON2.P$1 36.56,56.38 36.04,56.9 15.44,56.9 12.04,53.5 12.04,48.5
  Bottom 0.305: IC3.2 18.85,16.61 19.14,16.9 20.24,16.9 21.04,17.7 21.04,20.8 20.67,21.17 IC3.4 | R16.1 R17.1 R18.1 | U$1.PIN6 19.71,43.11 C5.1 | U$1.PIN26 22.21,37.91 v22.34,38.04 22.34,38.06 U$1.PIN22 | C4.1 16.84,40.66 16.24,40.06 U$1.PIN43
  Bottom 0.508: IC3.4 18.85,23 13.24,23 | R16.1 1.04,30.15 1.04,23.9 1.95,22.99 7.76,22.99 7.76,23 13.24,23 | v13.24,25.9 13.24,23
  other vias: 1.39,30.5 18.85,21.17 20.24,42.58 16.84,40.82
W_CURRENT
  Bottom 0.305: CON2.P$8 19.06,51.08 20.74,49.4 20.74,45.3 21.21,44.83 U$1.PIN9

### Text on the board
tPlace: 0.Hayate | MotaCon_MCU | ForCoRE | Reset | Stat | FF1 | FF2 | 4 | ID_Select | 1
bPlace: C | D | G | G | T | V | R | R | 5 | G | L | H | +